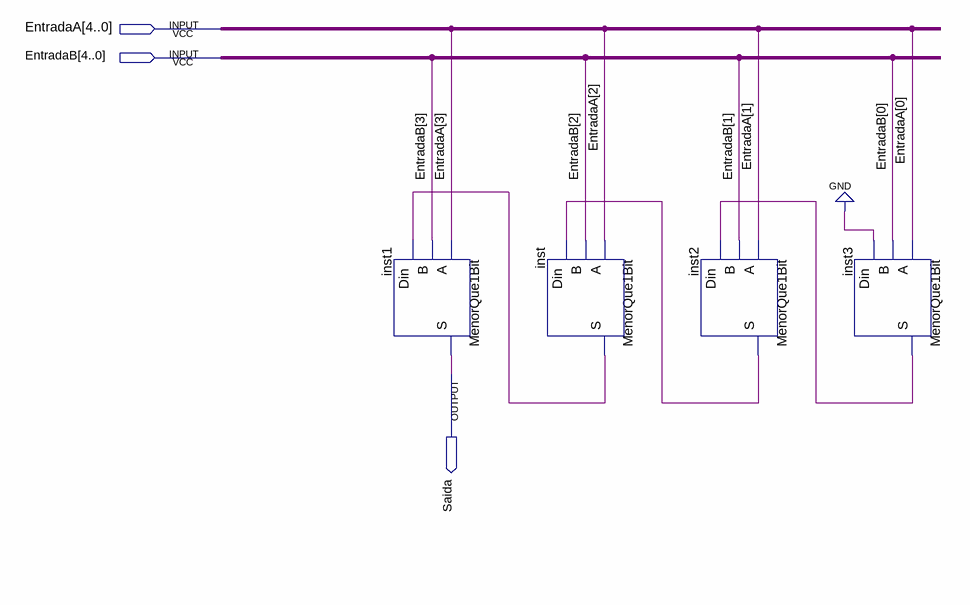
[diagram p0: schematic sheet]
// Quartus schematic MenorQue_magnitude.bdf as structural Verilog: 4 symbols, 3 pins
module MenorQue_magnitude (
  input  [4:0] EntradaA,
  input  [4:0] EntradaB,
  output Saida
);

  wire inst2_s, inst3_s, inst_s;

  MenorQue1Bit inst1 (.A(EntradaA[3]), .B(EntradaB[3]), .Din(inst_s), .S(Saida));
  MenorQue1Bit inst (.A(EntradaA[2]), .B(EntradaB[2]), .Din(inst2_s), .S(inst_s));
  MenorQue1Bit inst2 (.A(EntradaA[1]), .B(EntradaB[1]), .Din(inst3_s), .S(inst2_s));
  MenorQue1Bit inst3 (.A(EntradaA[0]), .B(EntradaB[0]), .Din(1'b0), .S(inst3_s));
endmodule
